# EAGLE design xbee breakout v10 (EAGLE 5.11)
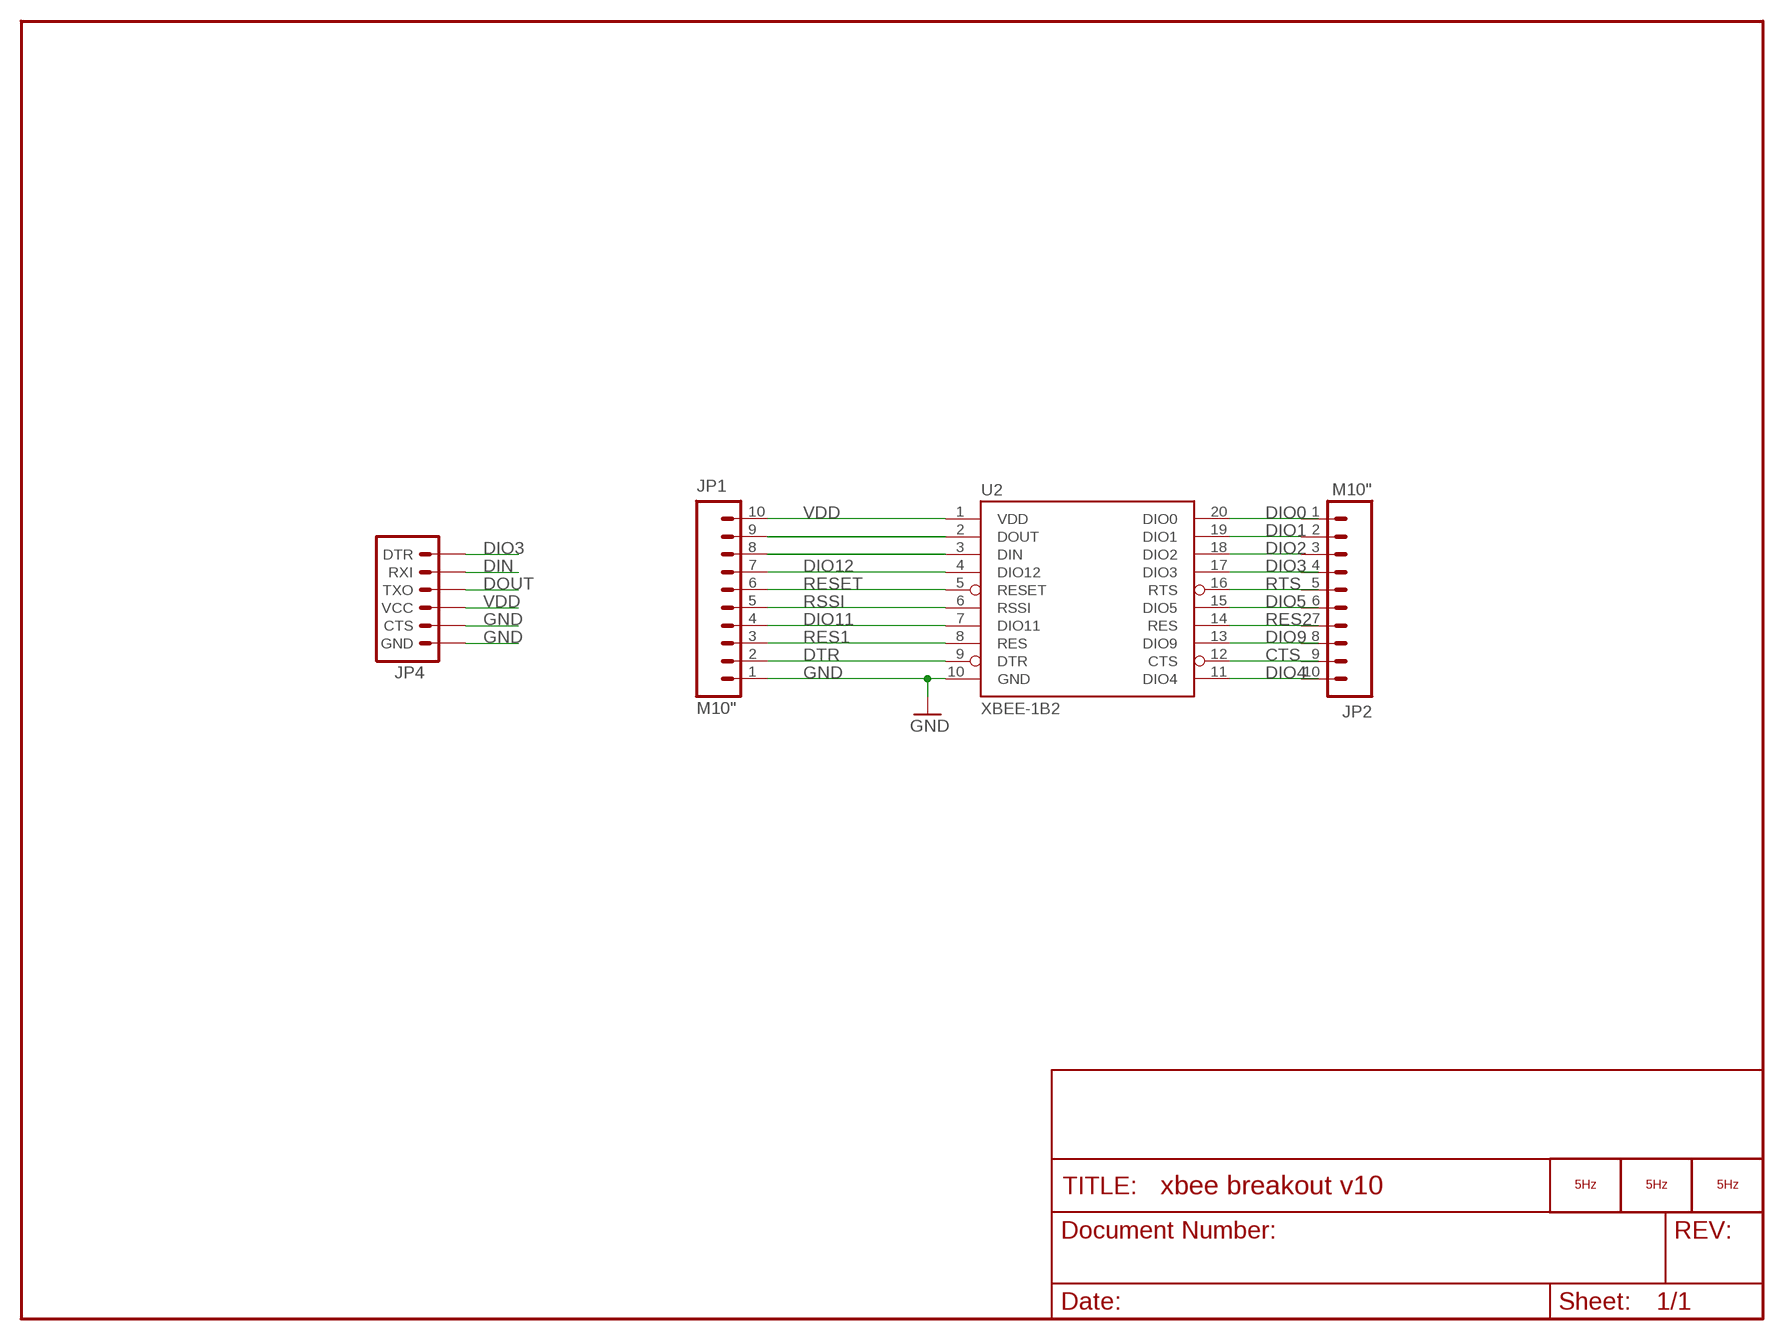
[diagram p0: schematic, sheet 1]

## Parts
JP1  M10"  [1X10]
JP2  M10"  [1X10]
JP4  ARDUINO_SERIAL_PROGRAMPTH  [1X06]
LOGO1  LOGO_5HZ_H_10MM  [5HZ_LOGO_H_10MM]
LOGO2  LOGO_5HZ_H_15MM  [5HZ_LOGO_H_15MM]
LOGO3  LOGO_5HZ_CIRC_3.5MM  [5HZ_LOGO_CIRC_3.5MM]
U2  XBEE-1B2  [XBEE-SILK]

## Nets
CTS: JP2.9 U2.12(CTS)
DIN: JP1.8 JP4.2(RXI) U2.3(DIN)
DIO0: JP2.1 U2.20(DIO0)
DIO1: JP2.2 U2.19(DIO1)
DIO2: JP2.3 U2.18(DIO2)
DIO3: JP2.4 JP4.1(DTR) U2.17(DIO3)
DIO4: JP2.10 U2.11(DIO4)
DIO5: JP2.6 U2.15(DIO5)
DIO9: JP2.8 U2.13(DIO9)
DIO11: JP1.4 U2.7(DIO11)
DIO12: JP1.7 U2.4(DIO12)
DOUT: JP1.9 JP4.3(TXO) U2.2(DOUT)
DTR: JP1.2 U2.9(DTR)
GND [vcc]: JP1.1 JP4.5(CTS) JP4.6(GND) U2.10(GND)
RES1: JP1.3 U2.8(RES)
RES2: JP2.7 U2.14(RES)
RESET: JP1.6 U2.5(RESET)
RSSI: JP1.5 U2.6(RSSI)
RTS: JP2.5 U2.16(RTS)
VDD [vcc]: JP1.10 JP4.4(VCC) U2.1(VDD)

## Library data of the parts
JP1 JP2 = SparkFun:M10: Header 10 Standard 10-pin 0.1" header. Use with straight break away headers (SKU : PRT-00116), right angle break away headers (PRT-00553), swiss pins (PRT-00743), machine pins (PRT-00117), and female headers (PRT-00115).
JP4 = SparkFun:ARDUINO_SERIAL_PROGRAM
LOGO1-LOGO3 = 5hz-electronica:LOGO_5HZ: Logotipo 5Hz "según Pedro"
U2 = SparkFun:XBEE-1

## Net classes
1 vcc: width 0.254 mm
2 gnd: width 0.254 mm

## Board
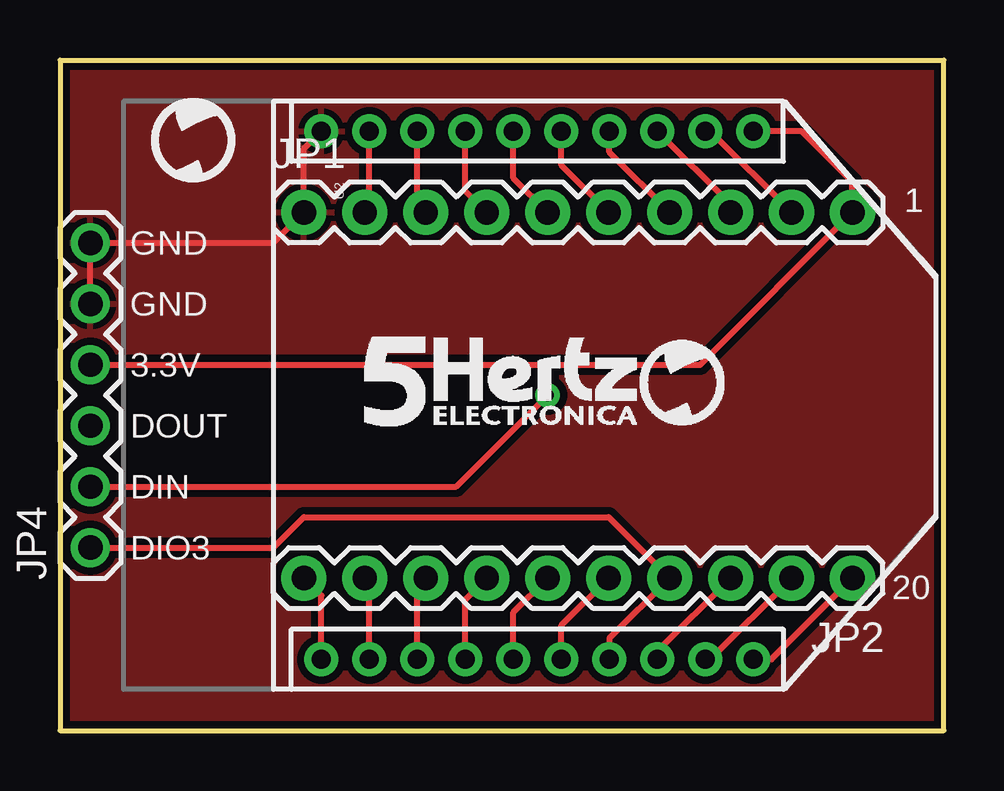
[diagram p1: board, top side]
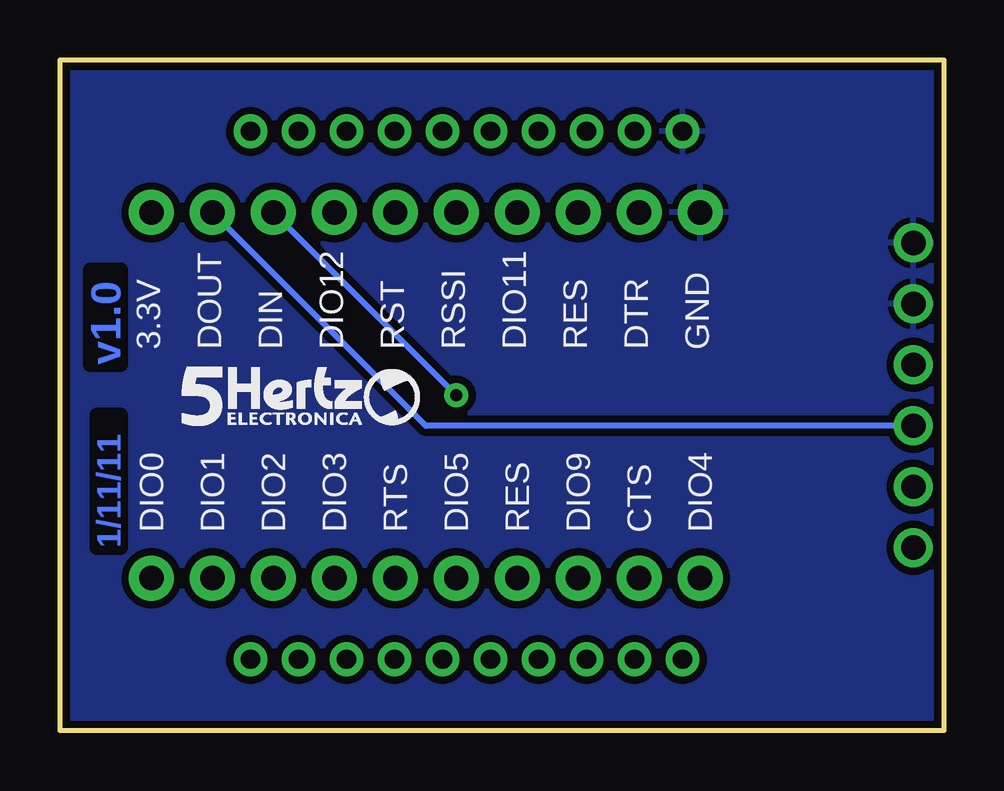
[diagram p2: board, bottom side, seen from below]

Size 36.83 x 27.94 mm. Coordinates in mm from the lower left corner, seen from the top.
Outline: 36.83,0 36.83,27.94 0,27.94 0,0 36.83,0
Copper layers (1*16): Top 0.035mm / dielectric 1.5mm / Bottom 0.035mm
Design rules "SparkFun": minimum track width 8mil, minimum drill 20mil, track to track 8mil, track to pad 8mil, pad to pad 8mil, via to via 8mil, smd to smd 8mil, copper to edge 10mil, drill to drill 8mil, minimum pad ring 12mil, minimum via ring 10mil, stop-mask expansion 4mil, vias tented up to drill 25mil, thermal gap 10mil

### Footprints (pad centres in the part's own frame; a part is rotated, then mirrored left to right if it is on the bottom)
1X10 = drill 1.016 pad 1.88 round: 1 0,0; 2 2.54,0; 3 5.08,0; 4 7.62,0; 5 10.16,0; 6 12.7,0; 7 15.24,0; 8 17.78,0; 9 20.32,0; 10 22.86,0
1X06 = drill 1.016 round: 1 0,0; 2 2.54,0; 3 5.08,0; 4 7.62,0; 5 10.16,0; 6 12.7,0
XBEE-SILK = drill 0.8 round: 1 -11,20; 2 -11,18; 3 -11,16; 4 -11,14; 5 -11,12; 6 -11,10; 7 -11,8; 8 -11,6; 9 -11,4; 10 -11,2; 11 11,2; 12 11,4; 13 11,6; 14 11,8; 15 11,10; 16 11,12; 17 11,14; 18 11,16; 19 11,18; 20 11,20

### Placement (x,y rotation side)
JP1  10.16,21.59 0 top
JP2  33.02,6.35 180 top
JP4  1.27,7.62 90 top
LOGO1  31.75,12.7 0 bottom
LOGO2  12.7,12.7 0 top
LOGO3  3.81,22.86 0 top
U2  8.89,13.97 270 top

### Tracks (layer width: path | path; a pad name or v marks a point on that pad's centre or on a via)
CTS
  Top 0.254: U2.12 12.89,6.16 JP2.9
DIN  (via drill 0.51)
  Top 0.254: JP4.2 16.51,10.16 v20.32,13.97 | JP1.8 27.94,21.92 U2.3
  Bottom 0.254: v20.32,13.97 JP1.8
DIO0
  Top 0.254: U2.20 29.64,2.97 JP2.1
DIO1
  Top 0.254: U2.19 27.1,2.97 JP2.2
DIO2
  Top 0.254: U2.18 24.89,3.3 JP2.3
DIO3
  Top 0.254: U2.17 22.89,3.84 JP2.4 22.86,8.89 10.16,8.89 8.89,7.62 JP4.1
DIO4
  Top 0.254: U2.11 10.89,5.62 JP2.10
DIO5
  Top 0.254: U2.15 18.89,4.92 JP2.6
DIO9
  Top 0.254: U2.13 14.89,6 JP2.8
DIO11
  Top 0.254: U2.7 16.89,22.48 JP1.4
DIO12
  Top 0.254: U2.4 22.89,24.1 JP1.7
DOUT
  Top 0.254: U2.2 27.1,24.97 JP1.9
  Bottom 0.254: JP4.3 21.59,12.7 JP1.9
DTR
  Top 0.254: U2.9 12.89,21.78 JP1.2
GND
  Top 0.254: JP4.5 JP4.6 8.89,20.32 JP1.1 10.16,24.24 U2.10
  pour Top (isolate 0.305): 0,27.94 36.83,27.94 36.83,0 0,0
  pour Bottom (isolate 0.305): 0,27.94 36.83,27.94 36.83,0 0,0
RES1
  Top 0.254: U2.8 14.89,21.94 JP1.3
RES2
  Top 0.254: U2.14 16.89,5.46 JP2.7
RESET
  Top 0.254: U2.5 20.89,23.56 JP1.6
RSSI
  Top 0.254: U2.6 18.89,23.02 JP1.5
RTS
  Top 0.254: U2.16 20.89,4.38 JP2.5
VDD
  Top 0.254: U2.1 30.91,24.97 33.02,22.86 JP1.10 26.67,15.24 JP4.4

### Text on the board
Bottom: v1.0 | 1/11/11
tPlace: 1 | GND | GND | 3.3V | DOUT | DIN | DIO3 | 20
bPlace: GND | DTR | RES | DIO11 | RSSI | RST | DIO12 | DIN | DOUT | 3.3V | DIO4 | CTS | DIO9 | RES | DIO5 | RTS | DIO3 | DIO2 | DIO1 | DIO0
tValues: XBee Socket Up | DNP | DNP | XBee Socket Up